# EAGLE design charger_pcb (EAGLE 7.3.0)
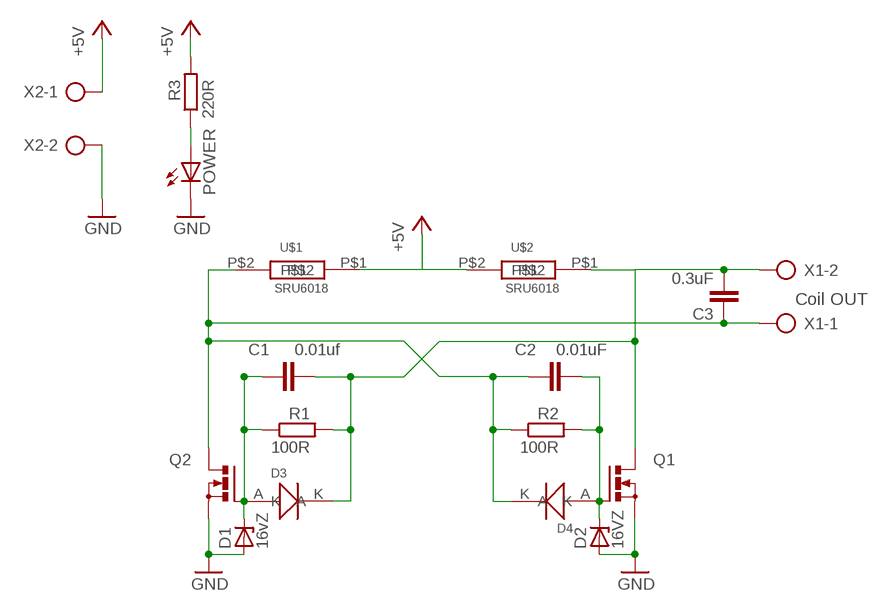
[diagram p0: schematic, sheet 1]

## Parts
C1  0.01uf  C-EUC0805  [C0805]
C2  0.01uF  C-EUC0805  [C0805]
C3  0.3uF  C-EUC0805  [C0805]
D1  16vZ  ZENER-DIODESOT23  [SOT23]
D2  16VZ  ZENER-DIODESOT23  [SOT23]
D3  DFLS240L  [POWERDI123]
D4  DFLS240L  [POWERDI123]
POWER  LEDCHIP-LED0805  [CHIP-LED0805]
Q1  N-MOSFET-SO8S  [SO-08]
Q2  N-MOSFET-SO8S  [SO-08]
R1  100R  R-EU_R0805  [R0805]
R2  100R  R-EU_R0805  [R0805]
R3  220R  R-EU_R0805  [R0805]
U$1  SRU6018  [SRU6018]
U$2  SRU6018  [SRU6018]
X1  AK500/2  [AK500/2]
X2  AK500/2  [AK500/2]

## Nets
+5V: R3.2 U$1.P$1 U$2.P$2 X2.1
GND: D1.1(A) D2.1(A) POWER.C Q1.1(S) Q1.2(S) Q1.3(S) Q2.1(S) Q2.2(S) Q2.3(S) X2.2
N$1: C1.1 D1.3(C) D3.A Q2.4(G) R1.1
N$3: C2.2 D2.3(C) D4.A Q1.4(G) R2.2
N$5: POWER.A R3.1
OUT1: C1.2 C3.2 D3.K Q1.5(D) Q1.6(D) Q1.7(D) Q1.8(D) R1.2 U$2.P$1 X1.2
OUT2: C2.1 C3.1 D4.K Q2.5(D) Q2.6(D) Q2.7(D) Q2.8(D) R2.1 U$1.P$2 X1.1

## Notes on the sheet
- Coil OUT

## Library data of the parts
C1-C3 = rcl:C-EU: CAPACITOR, European symbol
D1 D2 = diode:ZENER-DIODE: Z-Diode
D3 D4 = custom parts:DFLS240L
POWER = led:LED: LED OSRAM: - CHIPLED LG R971, LG N971, LY N971, LG Q971, LY Q971, LO R971, LY R971 LH N974, LH R974 LS Q976, LO Q976, LY Q976 LO Q996 - Hyper CHIPLED LW Q18S LB Q993, LB Q99A, LB R99A - SideLED LS A670, LO A670, LY A670, LG A670, LP A670 LB A673, LV A673, LT A673, LW A673 LH A674 LY A675 LS A676, LA A676, LO A676, LY A676, LW A676 LS A679, LY A679, LG A679 - Hyper Micro SIDELED® LS Y876, LA Y876, LO Y876, LY Y876 LT Y87S - SmartLED LW L88C, LW L88S LB L89C, LB L89S, LG L890 LS L89K, LO L89K, LY L89K LS L896, LA L896, LO L896, LY L896 - TOPLED LS T670, LO T670, LY T670, LG T670, LP T670 LSG T670, LSP T670, LSY T670, LOP T670, LYG T670 LG T671, LOG T671, LSG T671 LB T673, LV T673, LT T673, LW T673 LH T674 LS T676, LA T676, LO T676, LY T676, LB T676, LH T676, LSB T676, LW T676 LB T67C, LV T67C, LT T67C, LS T67K, LO T67K, LY T67K, LW E67C LS E67B, LA E67B, LO E67B, LY E67B, LB E67C, LV E67C, LT E67C LW T67C LS T679, LY T679, LG T679 LS T770, LO T770, LY T770, LG T770, LP T770 LB T773, LV T773, LT T773, LW T773 LH T774 LS E675, LA E675, LY E675, LS T675 LS T776, LA T776, LO T776, LY T776, LB T776 LHGB T686 LT T68C, LB T68C - Hyper Mini TOPLED® LB M676 - Mini TOPLED Santana® LG M470 LS M47K, LO M47K, LY M47K Source: http://www.osram.convergy.de LUXEON: - LUMILED® LXK2-PW12-R00, LXK2-PW12-S00, LXK2-PW14-U00, LXK2-PW14-V00 LXK2-PM12-R00, LXK2-PM12-S00, LXK2-PM14-U00 LXK2-PE12-Q00, LXK2-PE12-R00, LXK2-PE12-S00, LXK2-PE14-T00, LXK2-PE14-U00 LXK2-PB12-K00, LXK2-PB12-L00, LXK2-PB12-M00, LXK2-PB14-N00, LXK2-PB14-P00, LXK2-PB14-Q00 LXK2-PR12-L00, LXK2-PR12-M00, LXK2-PR14-Q00, LXK2-PR14-R00 LXK2-PD12-Q00, LXK2-PD12-R00, LXK2-PD12-S00 LXK2-PH12-R00, LXK2-PH12-S00 LXK2-PL12-P00, LXK2-PL12-Q00, LXK2-PL12-R00 Source: www.luxeon.com KINGBRIGHT: KA-3528ASYC Source: www.kingbright.com
Q1 Q2 = transistor-power:N-MOSFET-SO8: N-Channel MOSFET Example: FDS7760A; N-Channel Logic Level PowerTrench® MOSFET FDS2572; N-Channel UltraFET® Trench MOSFET Source: www.fairchildsemi.com
R1-R3 = rcl:R-EU_: RESISTOR, European symbol
U$1 U$2 = custom parts:SRU6018
X1 X2 = con-ptr500:AK500/2: CONNECTOR; OC_FARNELL: unknown; OC_NEWARK: unknown

## Board
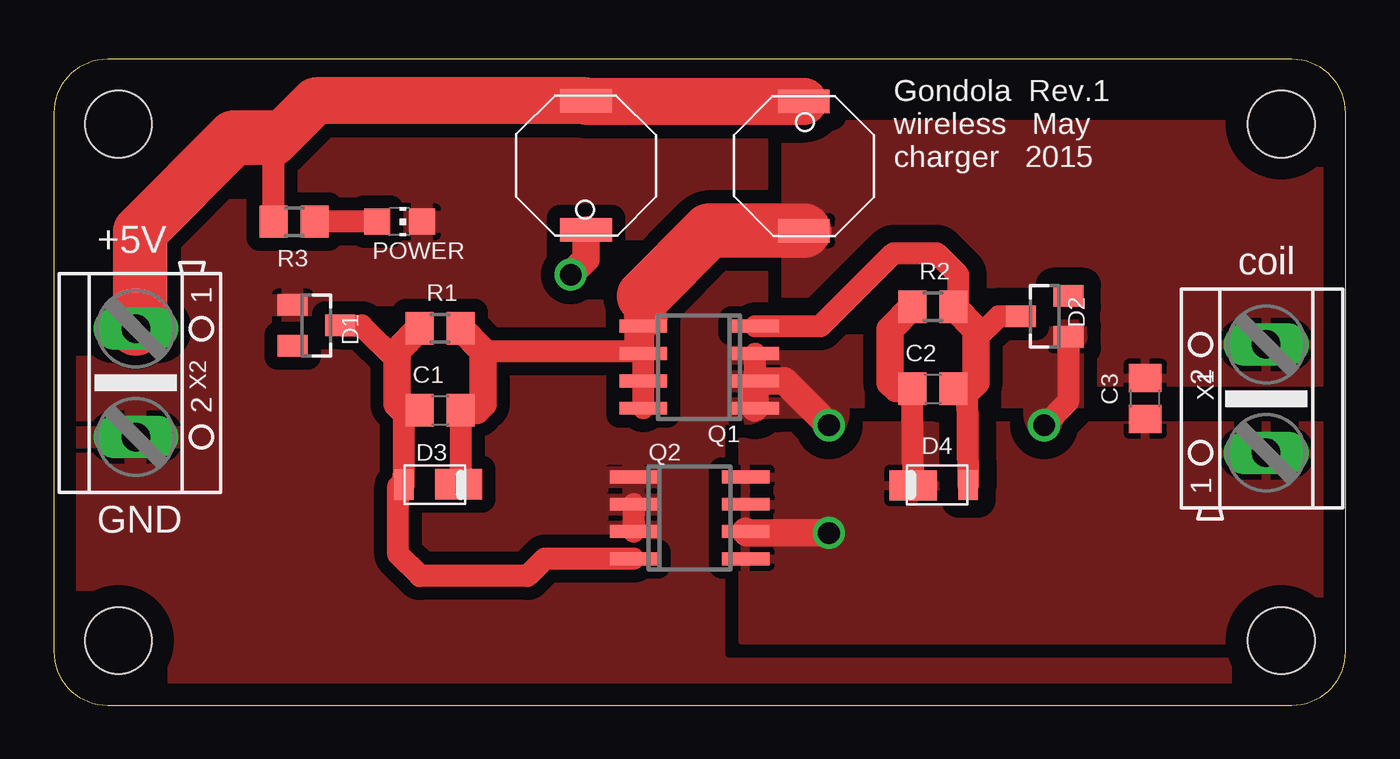
[diagram p1: board, top side]
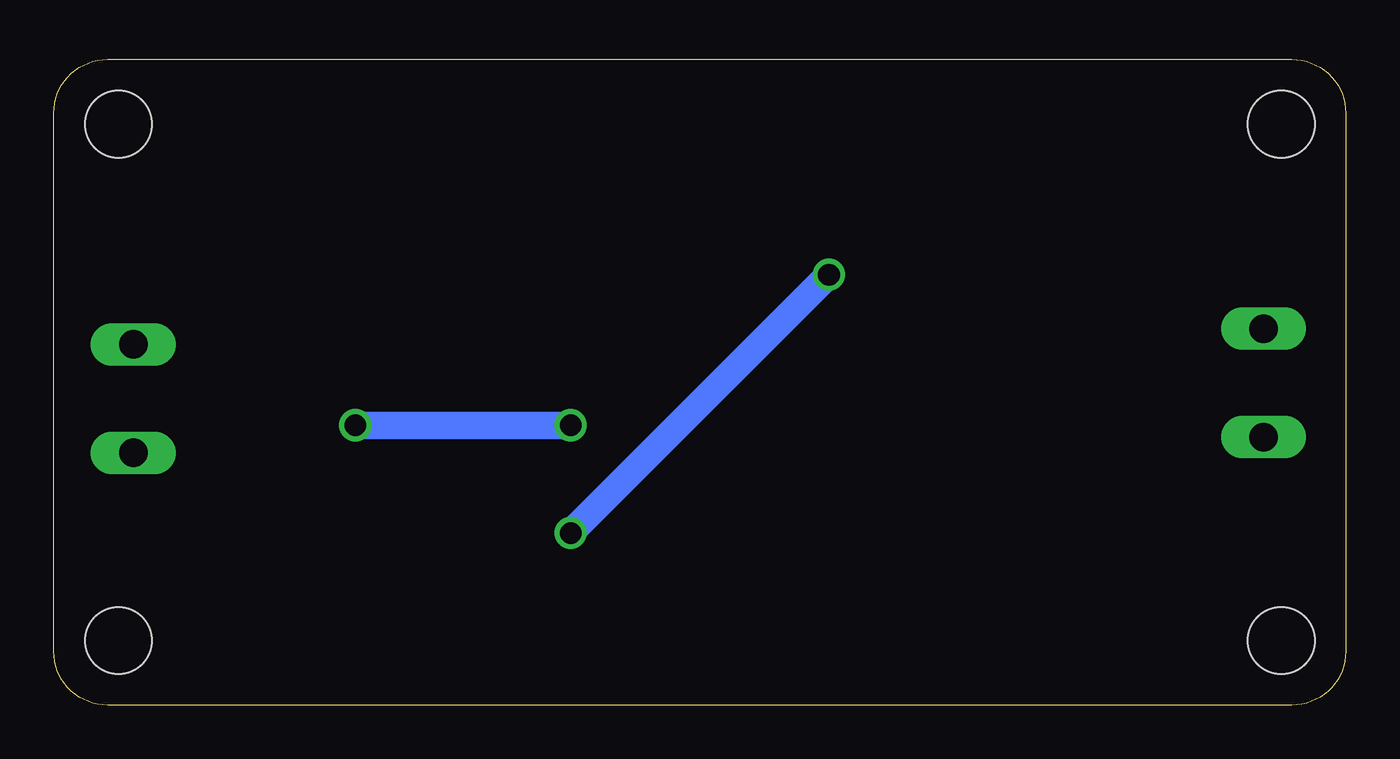
[diagram p2: board, bottom side, seen from below]

Size 60 x 30 mm. Coordinates in mm from the lower left corner, seen from the top.
Outline: 0,27.5 0,2.5 arc90 2.5,0 57.5,0 arc90 60,2.5 60,27.5 arc90 57.5,30 2.5,30 arc90 0,27.5
Copper layers (1*16): Top 0.035mm / dielectric 1.5mm / Bottom 0.035mm
Design rules "default": minimum track width 10mil, minimum drill 24mil, track to track 8mil, track to pad 8mil, pad to pad 8mil, via to via 8mil, smd to smd 8mil, copper to edge 40mil, drill to drill 8mil, minimum pad ring 10mil, minimum via ring 8mil, stop-mask expansion 4mil, vias tented up to drill 0mil, thermal gap 10mil
Holes 3.1 mm at 3,27 57,27 57,3 3,3

### Footprints (pad centres in the part's own frame; a part is rotated, then mirrored left to right if it is on the bottom)
C0805 = smd 1.3 x 1.5: 1 -0.95,0; 2 0.95,0
SOT23 = smd 1 x 1.4: 1 -0.95,-1.1; 2 0.95,-1.1; 3 0,1.1
POWERDI123 = smd 0.9 x 1.4: A 1.45,0 | smd 2.2 x 1.4: K -1.1,-0.025
CHIP-LED0805 = smd 1.2 x 1.2: A 0,-1.05; C 0,1.05
SO-08 = smd 0.6 x 2.2: 1 -1.905,-2.6; 2 -0.635,-2.6; 3 0.635,-2.6; 4 1.905,-2.6; 5 1.905,2.6; 6 0.635,2.6; 7 -0.635,2.6; 8 -1.905,2.6
R0805 = smd 1.3 x 1.5: 1 -0.95,0; 2 0.95,0
SRU6018 = smd 1.1 x 2.4: P$1 -3,0; P$2 3,0
AK500/2 = drill 1.321 long: 1 -2.515,0; 2 2.515,0

### Placement (x,y rotation side)
C1  17.94,13.7 0 top
C2  40.83,14.7 0 top
C3  50.69,14.24 90 top
D1  12.19,17.64 270 top
D2  46.02,18.06 90 top
D3  17.7,10.24 180 top
D4  41.02,10.23 0 top
POWER  16.06,22.46 270 top
Q1  29.97,15.7 90 top
Q2  29.53,8.7 270 top
R1  17.94,17.51 0 top
R2  40.83,18.51 0 top
R3  11.17,22.46 180 top
U$1  24.72,25.07 270 top
U$2  34.83,25.04 90 top
X1  56.31,14.24 90 top
X2  3.81,14.97 270 top

### Tracks (layer width: path | path; a pad name or v marks a point on that pad's centre or on a via)
+5V
  Top 1.016: R3.2 10.22,26.14 10,26.36
  Top 2.184: 10.22,26.14 12.15,28.07 U$1.P$1 24.75,28.04 U$2.P$2
  Top 2.54: 10,26.36 8.36,26.36 4,22 4,17.68 X2.1
GND  (via drill 1)
  Top 1.016: Q2.2 Q2.3 | Q1.2 Q1.3 | D2.1 47.12,14.12 v46,13
  Top 1.27: v36,13 33.94,15.06 Q1.2 Q1.1
  Bottom 1.27: v36,13 v46,13
  pour Top (isolate 0.61, rank 3): 0,0 0,30 60,30 60,0
N$1
  Top 1.016: Q2.4 22.8,6.79 22,6 17,6 16,7 16,10.17 D3.A 16.24,10.67 16.24,13.7 | D1.3 14.3,17.64 15.94,16
  Top 1.27: R1.1 15.94,16.46 15.94,16 15.94,14 16.24,13.7 C1.1
N$3
  Top 1.016: Q1.4 35.6,17.61 39,21 41,21 42,20 42,18.73 R2.2 | D4.A 42.43,14.8 42.83,15.2 | D2.3 43.89,18.06 42.83,17
  Top 1.27: R2.2 42.83,17.46 42.83,17 42.83,15.2 42.83,15 42.53,14.7 C2.2
N$5
  Top 1.016: POWER.A R3.1
OUT1
  Top 1.016: 19.94,16.46 27.25,16.46 Q1.6 | Q1.6 Q1.5 27.61,17.61 28,18 27,18 | Q1.6 Q1.7 Q1.8 | 27,18 27,16.7 Q1.6 | C1.2 18.89,10.6 D3.K | 27,18 27,18.6 27.4,19
  Top 1.27: R1.2 19.94,16.46 19.94,14 19.64,13.7 C1.2
  Top 2.54: U$2.P$1 30.44,22.04 27.4,19
  pour Top (isolate 0.813): 34,27 59,27 59,15 34,15
OUT2  (via drill 1)
  Top 1.016: D4.K 39.88,14.1 39.28,14.7
  Top 1.27: R2.1 38.83,17.46 38.83,15 39.13,14.7 39.28,14.7 C2.1 | 56.03,12 X1.1 | U$1.P$2 24.72,20.72 v24,20 | v36,8 32.2,8 Q2.6
  Bottom 1.27: v24,20 v36,8
  pour Top (isolate 0.813): 32,3 32,13 59,13 59,3

### Text on the board
tNames: Gondola Rev.1 / wireless May / charger 2015 | +5V | coil | GND